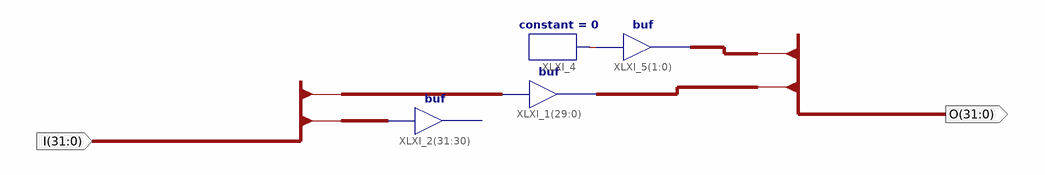
[diagram p0: schematic sheet 1]
// Xilinx ISE schematic shift_left_2b.sch (spartan3) as structural Verilog: 4 symbols, 2 ports
module shift_left_2b (
  input  [31:0] I,
  output [31:0] O
);

  wire XLXN_7;

  assign O[31:2] = I[29:0];  // buf XLXI_1[29..0], 30 bits wide
  // buf XLXI_2[31..30] has open pins: I=I[31:30], O=open
  constant #(.CValue("0")) XLXI_4 (.O(XLXN_7));
  assign O[1:0] = {2{XLXN_7}};  // buf XLXI_5[1..0], 2 bits wide
endmodule
